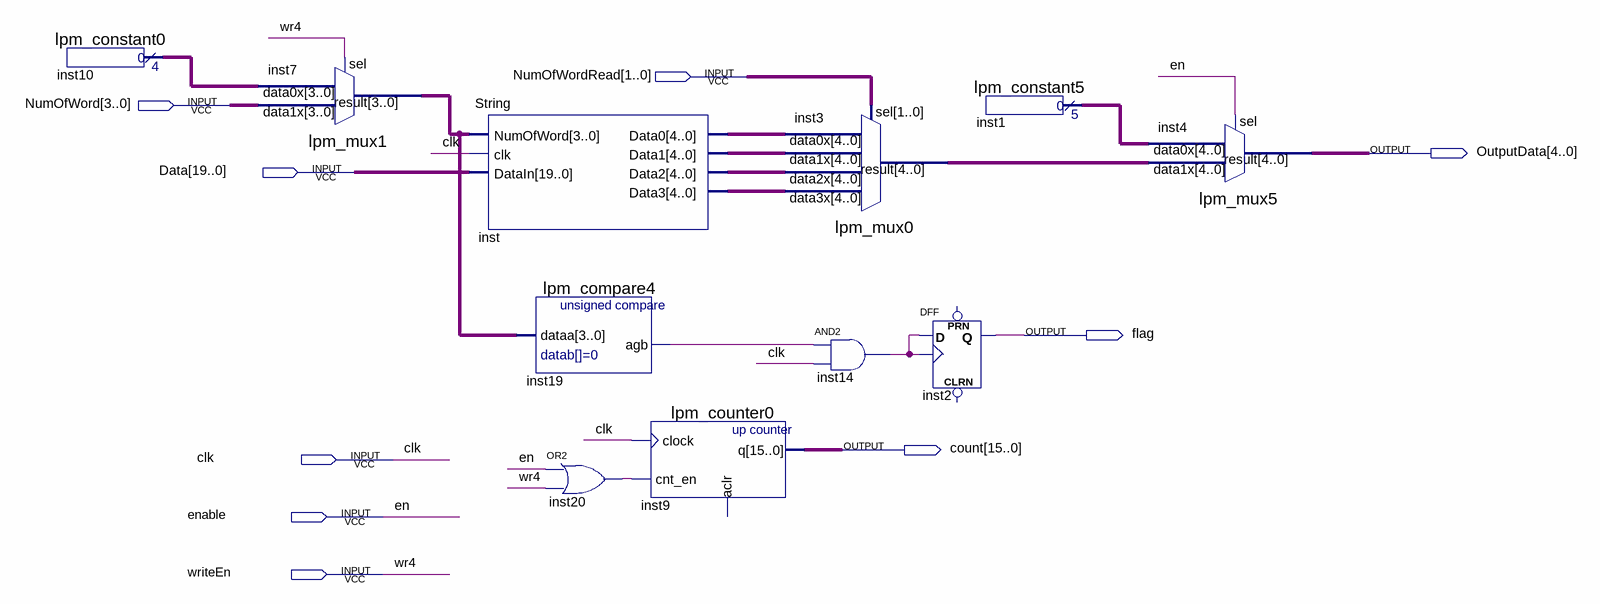
[diagram p0: schematic sheet]
// Quartus schematic CashBlock.bdf as structural Verilog: 11 symbols, 9 pins
module CashBlock (
  input  [1:0] NumOfWordRead,
  input  [3:0] NumOfWord,
  input  [19:0] Data,
  input  clk,
  input  enable,
  input  writeEn,
  output [4:0] OutputData,
  output flag,
  output [15:0] count
);

  wire inst14_out, inst19_agb, inst20_out;
  wire [3:0] inst7_result, inst10_result;
  wire [4:0] inst1_result, inst3_result, inst_data0, inst_data1, inst_data2, inst_data3;

  lpm_constant0 inst10 (.result(inst10_result));
  lpm_mux1 inst7 (.data1x(NumOfWord), .data0x(inst10_result), .sel(writeEn), .result(inst7_result));
  String inst (
    .NumOfWord(inst7_result), .clk(clk), .DataIn(Data), .Data0(inst_data0), .Data1(inst_data1),
    .Data2(inst_data2), .Data3(inst_data3));
  lpm_compare4 inst19 (.dataa(inst7_result), .agb(inst19_agb));
  or inst20 (inst20_out, enable, writeEn);
  lpm_counter0 inst9 (.clock(clk), .cnt_en(inst20_out), .q(count));  // open: aclr
  lpm_mux0 inst3 (
    .data3x(inst_data3), .data2x(inst_data2), .data1x(inst_data1), .data0x(inst_data0), .sel(NumOfWordRead),
    .result(inst3_result));
  and inst14 (inst14_out, inst19_agb, clk);
  DFF inst2 (.CLK(inst14_out), .D(inst14_out), .Q(flag));  // open: CLRN, PRN
  lpm_constant5 inst1 (.result(inst1_result));
  lpm_mux5 inst4 (.data1x(inst3_result), .data0x(inst1_result), .sel(enable), .result(OutputData));

  // Other names for the same wires on the sheet: en = enable; wr4 = writeEn
endmodule
